# Altium schematic sheet Power.SchDoc
size 420 x 297 mm; ENG_APP_DATE: --/--/--; DSN_APP_DATE: --/--/--; CHK_APP_DATE: --/--/--; Date: TEST; SheetNumber: 4; SheetTotal: 6; Sheet_Text_ProjectName: ApolloEcho_Dev_Kit; Sheet_Text_Author: mtnguyen; Sheet_Text_Title: Power; Sheet_Text_Rev: 2.0.0; Sheet_Text_Date: Mar 01, 25; SPICEModelCacheVANAQJKB: <root> / <DocumentId>VANAQJKB</DocumentId> / <CacheFrame Number="0"> / <Model Name="emk105bj105_v-f" Kind="CKT"> / <Text>* EMK105BJ105_V-F     SPICE MODEL  ( General Type ) / *-------------------------------------------------------------------------------------------------------- / * Model Generated by TAIYO YUDEN Corporation (http://www.ty-top.com) / * Version 1.0 / * TAIYO YUDEN Control No. 170508_130520 / * Copyright(c) 2012 TAIYO YUDEN CO.,LTD. All Rights Reserved. / *-------------------------------------------------------------------------------------------------------- / * / * Products Name : Multilayer Ceramic Capacitors / * / * Characteristics : / *     Capacitance : 1 uF , Rated Voltage : 16V , TCC : X5R / *     Case Size : 1.0 x 0.5 / 0.039 x 0.02 [mm/inch] , Thickness : 0.5 / 0.02 [mm/inch] / *     (Conditions: Temperature = 25 degC , DC Bias Current/Voltage = 0A / 0V) / * / * Frequency Range : 40Hz - 3GHz / * / * External Node Assignments : / * / *  1  o---| |---o  2 / * / *-------------------------------------------------------------------------------------------------------- / .SubCkt EMK105BJ105_V-F 1 2 / **************************** / C0 1 110 0.68309u / Cm 1 101 0.26053u / C1 101 102 0.94076u / Rc1 101 102 1.9029k / C2 102 103 0.66707u / Rc2 102 103 120.36 / C3 103 110 0.57203u / Rc3 103 110 2.1097 / C2m 1 301 0.1871u / C21 301 302 3.2494u / Rc21 301 302 1.1117k / C22 302 303 2.1014u / Rc22 302 303 1.484k / C23 303 304 2.1172u / Rc23 303 304 1.3876k / C24 304 305 0.75729u / Rc24 304 305 332.59 / C25 305 306 0.94401u / Rc25 305 306 249.09 / C26 306 307 0.34674u / Rc26 306 307 28.352 / C27 307 308 0.37158u / Rc27 307 308 19.989 / C28 308 309 0.17933u / Rc28 308 309 31.748 / C29 309 110 0.016445u / Rc29 309 110 1.0592 / Rp0 1 110 100Meg / L0 110 120 0.2216n / Lm 120 130 0.1509n / L1 120 121 0.12659n / RL1 121 130 0.85161 / L2 120 122 0.15996n / RL2 122 130 0.42469 / L3 120 123 7.9543n / RL3 123 130 0.54643m / CR 120 124 0.24334u / LR 124 125 0.090738n / RR 125 130 68.076m / CL 130 140 2.7354p / LL 130 140 0.10762n / RL 130 140 50.614 / Rs 140 2 7.5416m / **************************** / .ends EMK105BJ105_V-F</Text> / </Model> / </CacheFrame> / </root>
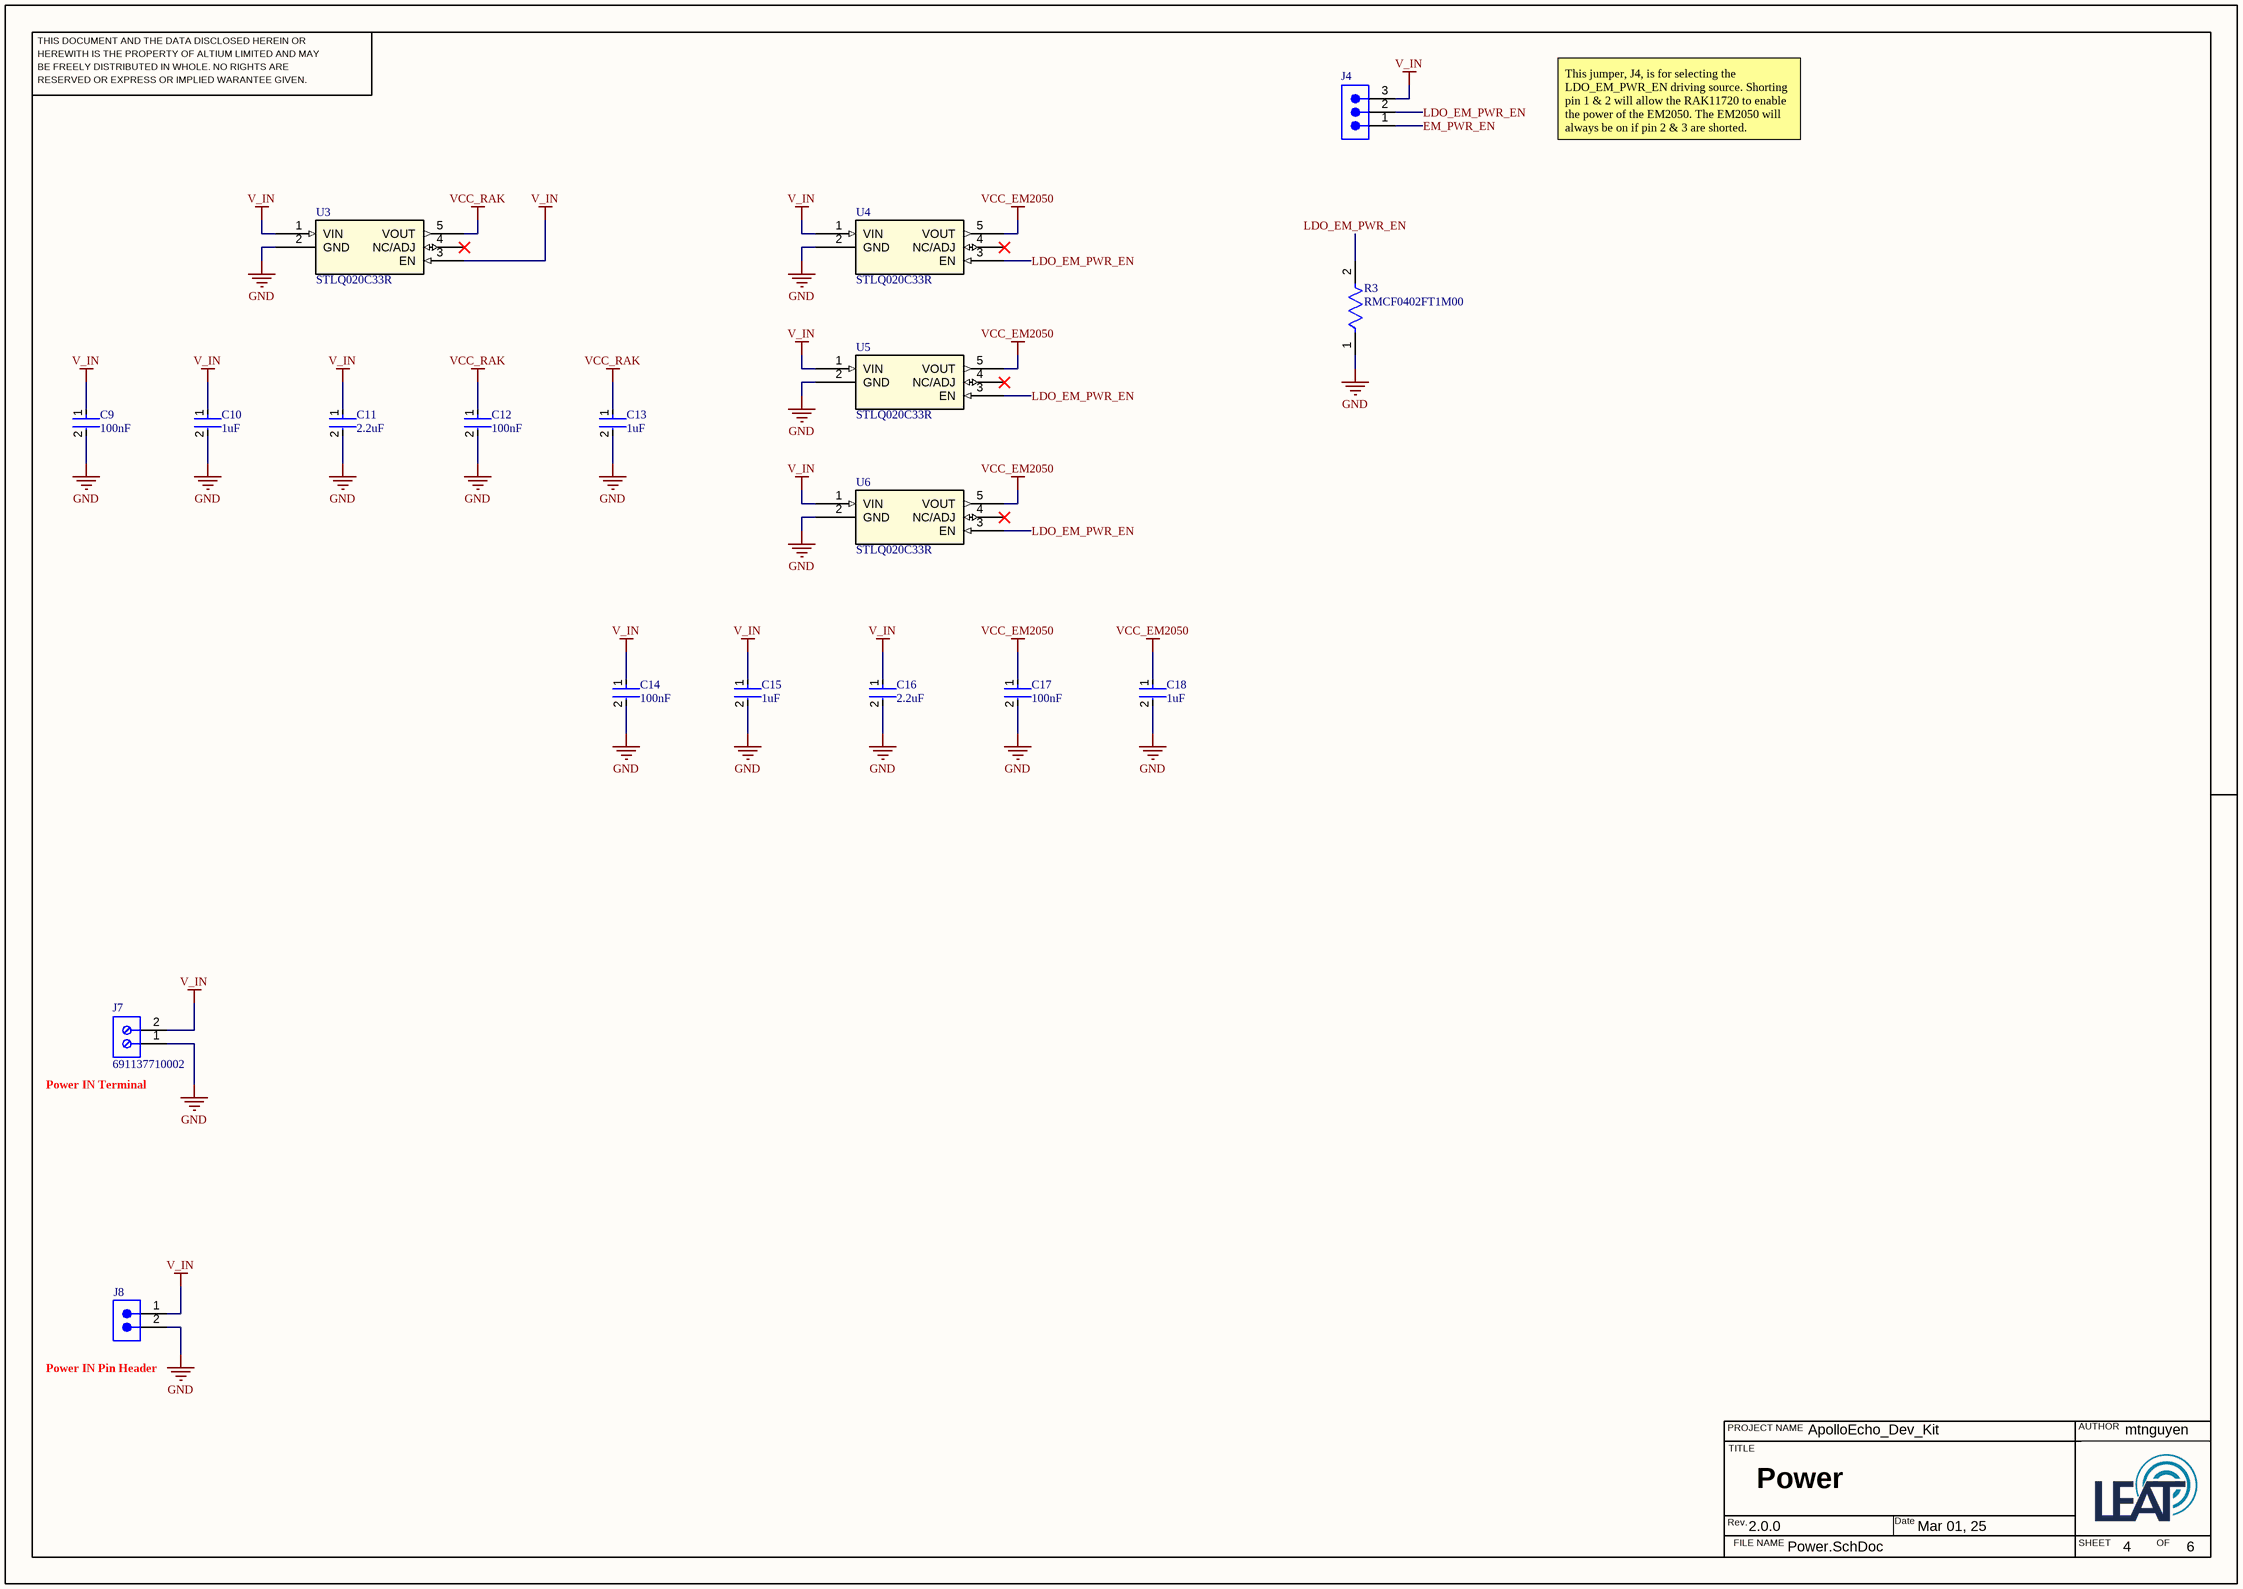
[diagram p0: Power.SchDoc]

## Parts
C9  Capacitance: 100nF  [FP-0402-L_1_0_1-W_0_5_0_1-IPC_C]  (hidden comment: 0402ZD104KAT2A)
C10  Capacitance: 1uF  [FP-0402-L_1_0_0_05-W_0_5-IPC_A]  (hidden comment: EMK105BJ105KV-F)
C11  Capacitance: 2.2uF  [FP-C1005-050-0_05-IPC_A]  (hidden comment: C1005X5R1A225K050BC)
C12  Capacitance: 100nF  [FP-0402-L_1_0_1-W_0_5_0_1-IPC_C]  (hidden comment: 0402ZD104KAT2A)
C13  Capacitance: 1uF  [FP-0402-L_1_0_0_05-W_0_5-IPC_A]  (hidden comment: EMK105BJ105KV-F)
C14  Capacitance: 100nF  [FP-0402-L_1_0_1-W_0_5_0_1-IPC_C]  (hidden comment: 0402ZD104KAT2A)
C15  Capacitance: 1uF  [FP-0402-L_1_0_0_05-W_0_5-IPC_A]  (hidden comment: EMK105BJ105KV-F)
C16  Capacitance: 2.2uF  [FP-C1005-050-0_05-IPC_A]  (hidden comment: C1005X5R1A225K050BC)
C17  Capacitance: 100nF  [FP-0402-L_1_0_1-W_0_5_0_1-IPC_C]  (hidden comment: 0402ZD104KAT2A)
C18  Capacitance: 1uF  [FP-0402-L_1_0_0_05-W_0_5-IPC_A]  (hidden comment: EMK105BJ105KV-F)
J4  61300311121  [61300311121]  (value not drawn)
J7  691137710002  [691137710002]
J8  61300211121  [61300211121]  (value not drawn)
R3  RMCF0402FT1M00  [FP-RMCF0402-MFG]
U3  STLQ020C33R  [SOT323-5L_STM]
U4  STLQ020C33R  [SOT323-5L_STM]
U5  STLQ020C33R  [SOT323-5L_STM]
U6  STLQ020C33R  [SOT323-5L_STM]

## Nets
GND: C9.2 C10.2 C11.2 C12.2 C13.2 C14.2 C15.2 C16.2 C17.2 C18.2 J7.1 J8.2 R3.1 U3.2(GND) U4.2(GND) U5.2(GND) U6.2(GND)
V_IN: C9.1 C10.1 C11.1 C14.1 C15.1 C16.1 J4.3 J7.2 J8.1 U3.1(VIN) U3.3(EN) U4.1(VIN) U5.1(VIN) U6.1(VIN)
VCC_EM2050: C17.1 C18.1 U4.5(VOUT) U5.5(VOUT) U6.5(VOUT)
VCC_RAK: C12.1 C13.1 U3.5(VOUT)
EM_PWR_EN: J4.1
LDO_EM_PWR_EN: J4.2 R3.2 U4.3(EN) U5.3(EN) U6.3(EN)

Not connected (* = marked no-connect by the designer): U3 4(NC/ADJ)*; U4 4(NC/ADJ)*; U5 4(NC/ADJ)*; U6 4(NC/ADJ)*

## Notes on the sheet
- This jumper, J4, is for selecting the LDO_EM_PWR_EN driving source. Shorting pin 1 & 2 will allow the RAK11720 to enable the power of the EM2050. The EM2050 will always be on if pin 2 & 3 are shorted.
- (near J7) Power IN Terminal
- (near J8) Power IN Pin Header
- THIS DOCUMENT AND THE DATA DISCLOSED HEREIN OR
- HEREWITH IS THE PROPERTY OF ALTIUM LIMITED AND MAY
- BE FREELY DISTRIBUTED IN WHOLE. NO RIGHTS ARE
- RESERVED OR EXPRESS OR IMPLIED WARANTEE GIVEN.
- PROJECT NAME
- TITLE
- AUTHOR
- Rev.
- FILE NAME
- Date
- SHEET
- OF

## Library data of the parts
C9 C12 C14 C17 = CMP-2008-02878-3: General Purpose Ceramic Capacitor, 0402, 100nF, 10%, X5R, 15%, 10V; Dissipation Factor: 5%; Insulation Resistance: 100GR; Case/Package: 0402; Termination: SMD/SMT; Thickness: 0.022inch; Packaging: Tape and Reel; REACH SVHC: No SVHC; Case Code (Imperial): 0402; Width: 0.02inch; Series: -; Construction: Flat; Dielectric: X5R; Voltage: 10V; Height: 0.56mm; Voltage Rating (DC): 10V; Depth: 0.5mm; Tolerance: 10%; Radiation Hardening: No; Voltage Rating: 10V; Package Quantity: 1; Contact Plating: Tin; RoHS Compliant: Yes; Case Code (Metric): 1005; Lead Free: Lead Free; Max Operating Temperature: 85°C; Length: 1mm; Min Operating Temperature: -55°C; Mount: Surface Mount
C10 C13 C15 C18 = CMP-14477-000104-2: None; Tolerance: 10%; Voltage Rating: 16V; Dielectric: X5R; Packaging: Tape and Reel; Depth: 0.5mm; Mount: Surface Mount; Thickness: 0.022inch; Package Quantity: 1; Min Operating Temperature: -55°C; Series: M; Voltage Rating (DC): 16V; Termination: SMD/SMT; Case/Package: 0402; Number of Pins: 2; Case Code (Imperial): 0402; Length: 1mm; Halogen Free: Halogen Free; Case Code (Metric): 1005; Width: 0.02inch; RoHS Compliant: Yes; Radiation Hardening: No; Max Operating Temperature: 85°C; Height: 0.5mm; Construction: Flat
C11 C16 = CMP-08246-002709-1: Multilayer Ceramic Capacitors 2.2μF ±10% 10V X5R SMD 0402; Packaging: Tape and Reel; REACH SVHC: No SVHC; Case Code (Imperial): 0402; Voltage Rating: 10V; Radiation Hardening: No; Construction: Flat; Case/Package: 0402; Width: 0.02inch; Length: 1mm; Dielectric Material: Ceramic; Series: C; Height: 0.5mm; Depth: 0.5mm; Thickness: 0.022inch; Tolerance: 10%; Package Quantity: 1; Case Code (Metric): 1005; Min Operating Temperature: -55°C; Dielectric: X5R; Number of Pins: 2; Mount: Surface Mount; Resistor Type: Ceramic; RoHS Compliant: Yes; Weight: 2.3E-05oz; Max Operating Temperature: 85°C; Lead Free: Lead Free; Voltage: 10V; Termination: SMD/SMT; Voltage Rating (DC): 10V
J4 = CMP-1502-01062-3: NexarPartId: 32855521; Current Rating: 3A; Voltage Rating: 250V; Number of Positions: 3; Pitch: 2.54mm; Contact Resistance: 20mΩ; Connector Type: Male Pin; Gender: Male; REACH SVHC: Unknown; Packaging: Bulk; Contact Material: Copper; Min Operating Temperature: -40°C; Number of Rows: 1; Orientation: Vertical; RoHS: Compliant; Contact Plating: Gold; Max Operating Temperature: 105°C; Mount: Through Hole; Height: 8.94mm; Operating Supply Voltage: 250V; Number of Pins: 3; Contact Mating Length: 5.9944mm; Number of Contacts: 3; Color: Black; Lead Free: Lead Free; Lead Pitch: 2.54mm; Termination: Solder
J7 = CMP-1502-03324-2: NexarPartId: 78871135; Voltage Rating: 300V; Number of Contacts: 2; Current Rating: 16A; Lead Pitch: 5mm; Height: 11.6mm; Packaging: Box; RoHS: Non-Compliant; Contact Material: Nickel, Tin; Max Operating Temperature: 120°C; Number of Pins: 2; Min Operating Temperature: -30°C; Number of Rows: 1
J8 = CMP-1712-00002-6: NexarPartId: 20081794; Number of Contacts: 2; Pitch: 2.54mm; Connector Type: Male Pin; Voltage Rating: 250V; Current Rating: 3A; Gender: Male; Contact Resistance: 20mΩ; Height: 8.94mm; Lead Free: Lead Free; Number of Pins: 2; Termination: Through Hole; RoHS: Compliant; Lead Pitch: 2.54mm; REACH SVHC: No SVHC; Housing Material: PBT; Contact Mating Length: 5.9944mm; Min Operating Temperature: -40°C; Orientation: Vertical; Contact Material: Copper; Contact Gender: Male; Max Operating Temperature: 125°C; Number of Rows: 1; Number of Positions: 2; Packaging: Bulk; Contact Plating: Gold; Mount: Through Hole; Color: Black; Operating Supply Voltage: 250V
R3 = CMP-2000-06985-2: 1MΩ ±1% 0.063W 0402 Thick Film Chip Resistor AEC-Q200 compliant; Max Power Dissipation: 63mW; Resistance: 1MR; Power Rating: 62.5mW; Temperature Coefficient: 100ppm/°C; Resistor Type: Thick Film; Military Standard: Not; Packaging: Tape and Reel; Radiation Hardening: No; Construction: Rectangular; Length: 1mm; Case/Package: 0402; Width: 0.02inch; Case Code (Imperial): 0402; Lead Free: Lead Free; Number of Terminations: 2; Min Operating Temperature: -55°C; Height: 0.016inch; Tolerance: 1%; Contact Plating: Tin; Case Code (Metric): 1005; Depth: 0.5mm; Features: Automotive AEC-Q200; Max Operating Temperature: 155°C; Size Code: 0402; Mount: Surface Mount; RoHS Compliant: Yes; Series: RMCF
U3-U6 = STLQ020C33R: No Description Available; Mfr_Name: STMicroelectronics; Copyright: Copyright (C) 2023 Ultra Librarian. All rights reserved.; Manufacturer_Part_Number: STLQ020C33R; RefDes: RefDes; Type: DEV